# EAGLE schematic synapse (EAGLE 7.3.0)

## Sheet 1 of 2
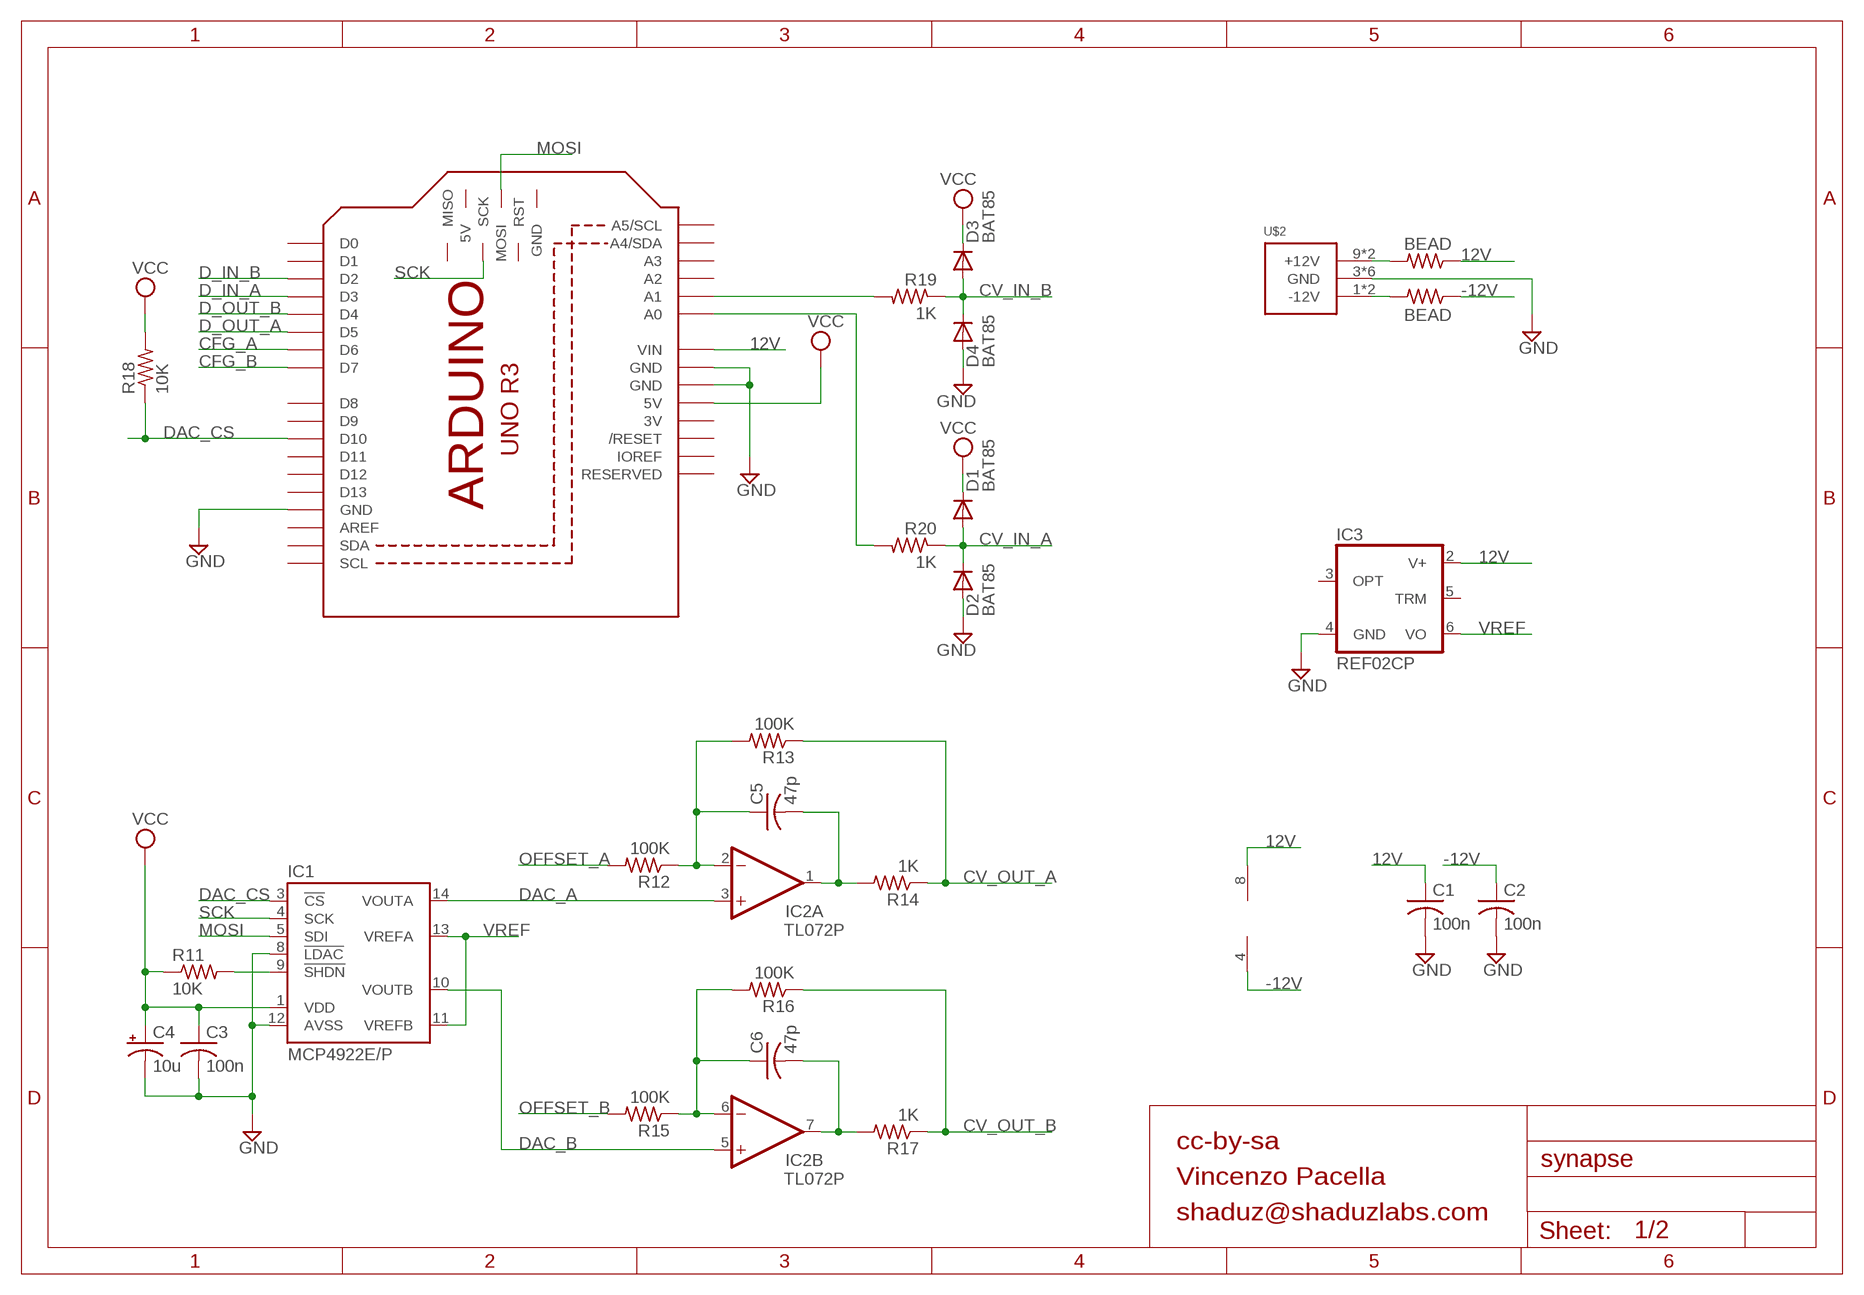
[diagram p0: schematic, sheet 1]

### Parts
C1  100n  C-US025-025X050  [C025-025X050]
C2  100n  C-US025-025X050  [C025-025X050]
C3  100n  C-US025-025X050  [C025-025X050]
C4  10u  CPOL-USE2-5  [E2-5]
C5  47p  C-US025-025X050  [C025-025X050]
C6  47p  C-US025-025X050  [C025-025X050]
D1  BAT85  DIODE-D-5  [D-5]
D2  BAT85  DIODE-D-5  [D-5]
D3  BAT85  DIODE-D-5  [D-5]
D4  BAT85  DIODE-D-5  [D-5]
IC1  MCP4922E/P  [DIL14]
IC2  TL072P  [DIL08]
IC3  REF02CP  REF02Z  [DIL08]
M1  ARDUINO_R3_ICSP  [ARDUINOR3_ICSP]
R11  10K  R-US_0204/7  [0204/7]
R12  100K  R-US_0204/7  [0204/7]
R13  100K  R-US_0204/7  [0204/7]
R14  1K  R-US_0204/7  [0204/7]
R15  100K  R-US_0204/7  [0204/7]
R16  100K  R-US_0204/7  [0204/7]
R17  1K  R-US_0204/7  [0204/7]
R18  10K  R-US_0204/7  [0204/7]
R19  1K  R-US_0204/7  [0204/7]
R20  1K  R-US_0204/7  [0204/7]
R21  BEAD  R-US_0204/7  [0204/7]
R24  BEAD  R-US_0204/7  [0204/7]
U$2  POWER_SIMPLE10  [POWER_10]

### Nets
12V [PWR]: C1.1 IC2.8(P:V+) IC3.2(V+) M1.VIN R21.1
-12V [PWR]: C2.1 IC2.4(P:V-) R24.1
CFG_A: M1.D6 ; also sheet 2
CFG_B: M1.D7 ; also sheet 2
CV_IN_A: D1.A D2.C R20.1 ; also sheet 2
CV_IN_B: D3.A D4.C R19.1 ; also sheet 2
CV_OUT_A: R13.1 R14.1 ; also sheet 2
CV_OUT_B: R16.1 R17.1 ; also sheet 2
D_IN_A: M1.D3 ; also sheet 2
D_IN_B: M1.D2 ; also sheet 2
D_OUT_A: M1.D5 ; also sheet 2
D_OUT_B: M1.D4 ; also sheet 2
DAC_A: IC1.14(VOUTA) IC2.3(A:+IN)
DAC_B: IC1.10(VOUTB) IC2.5(B:+IN)
DAC_CS: IC1.3(!CS!) M1.D10 R18.1
GND [PWR]: C1.2 C2.2 C3.2 C4.- D2.A D4.A IC1.8(!LDAC!) IC1.12(AVSS) IC3.4(GND) M1.GND M1.GND@1(GND) M1.GND@3(GND) U$2.3(GND) U$2.4(GND) U$2.5(GND) U$2.6(GND) U$2.7(GND) U$2.8(GND) ; also sheet 2
MOSI: IC1.5(SDI) M1.MOSI
N$1: M1.A1 R19.2
N$2: IC1.9(!SHDN!) R11.2
N$5 [PWR]: R21.2 U$2.9(+12V) U$2.10(+12V)
N$8 [PWR]: R24.2 U$2.1(-12V) U$2.2(-12V)
N$9: M1.A0 R20.2
N$22: C5.1 IC2.2(A:-IN) R12.1 R13.2
N$23: C6.1 IC2.6(B:-IN) R15.1 R16.2
N$24: C5.2 IC2.1(A:OUT) R14.2
N$25: C6.2 IC2.7(B:OUT) R17.2
OFFSET_A: R12.2 ; also sheet 2
OFFSET_B: R15.2 ; also sheet 2
SCK: IC1.4(SCK) M1.SCK
VCC: C3.1 C4.+ D1.C D3.C IC1.1(VDD) M1.5V R11.1 R18.2 ; also sheet 2
VREF: IC1.11(VREFB) IC1.13(VREFA) IC3.6(VO) ; also sheet 2
Unconnected: IC3.3(OPT) IC3.5(TRM) M1.5V_ICSP(5V) M1.A2 M1.A3 M1.A4(A4/SDA) M1.A5(A5/SCL) M1.AREF M1.D0 M1.D1 M1.D8 M1.D9 M1.D11 M1.D12 M1.D13 M1.GND@2(GND) M1.IOREF M1.MISO M1.RESERVED M1.RESET(/RESET) M1.RESET_ICSP(RST) M1.SCL M1.SDA

### Notes on the sheet
- cc-by-sa
- Vincenzo Pacella
- shaduz@shaduzlabs.com

## Sheet 2 of 2
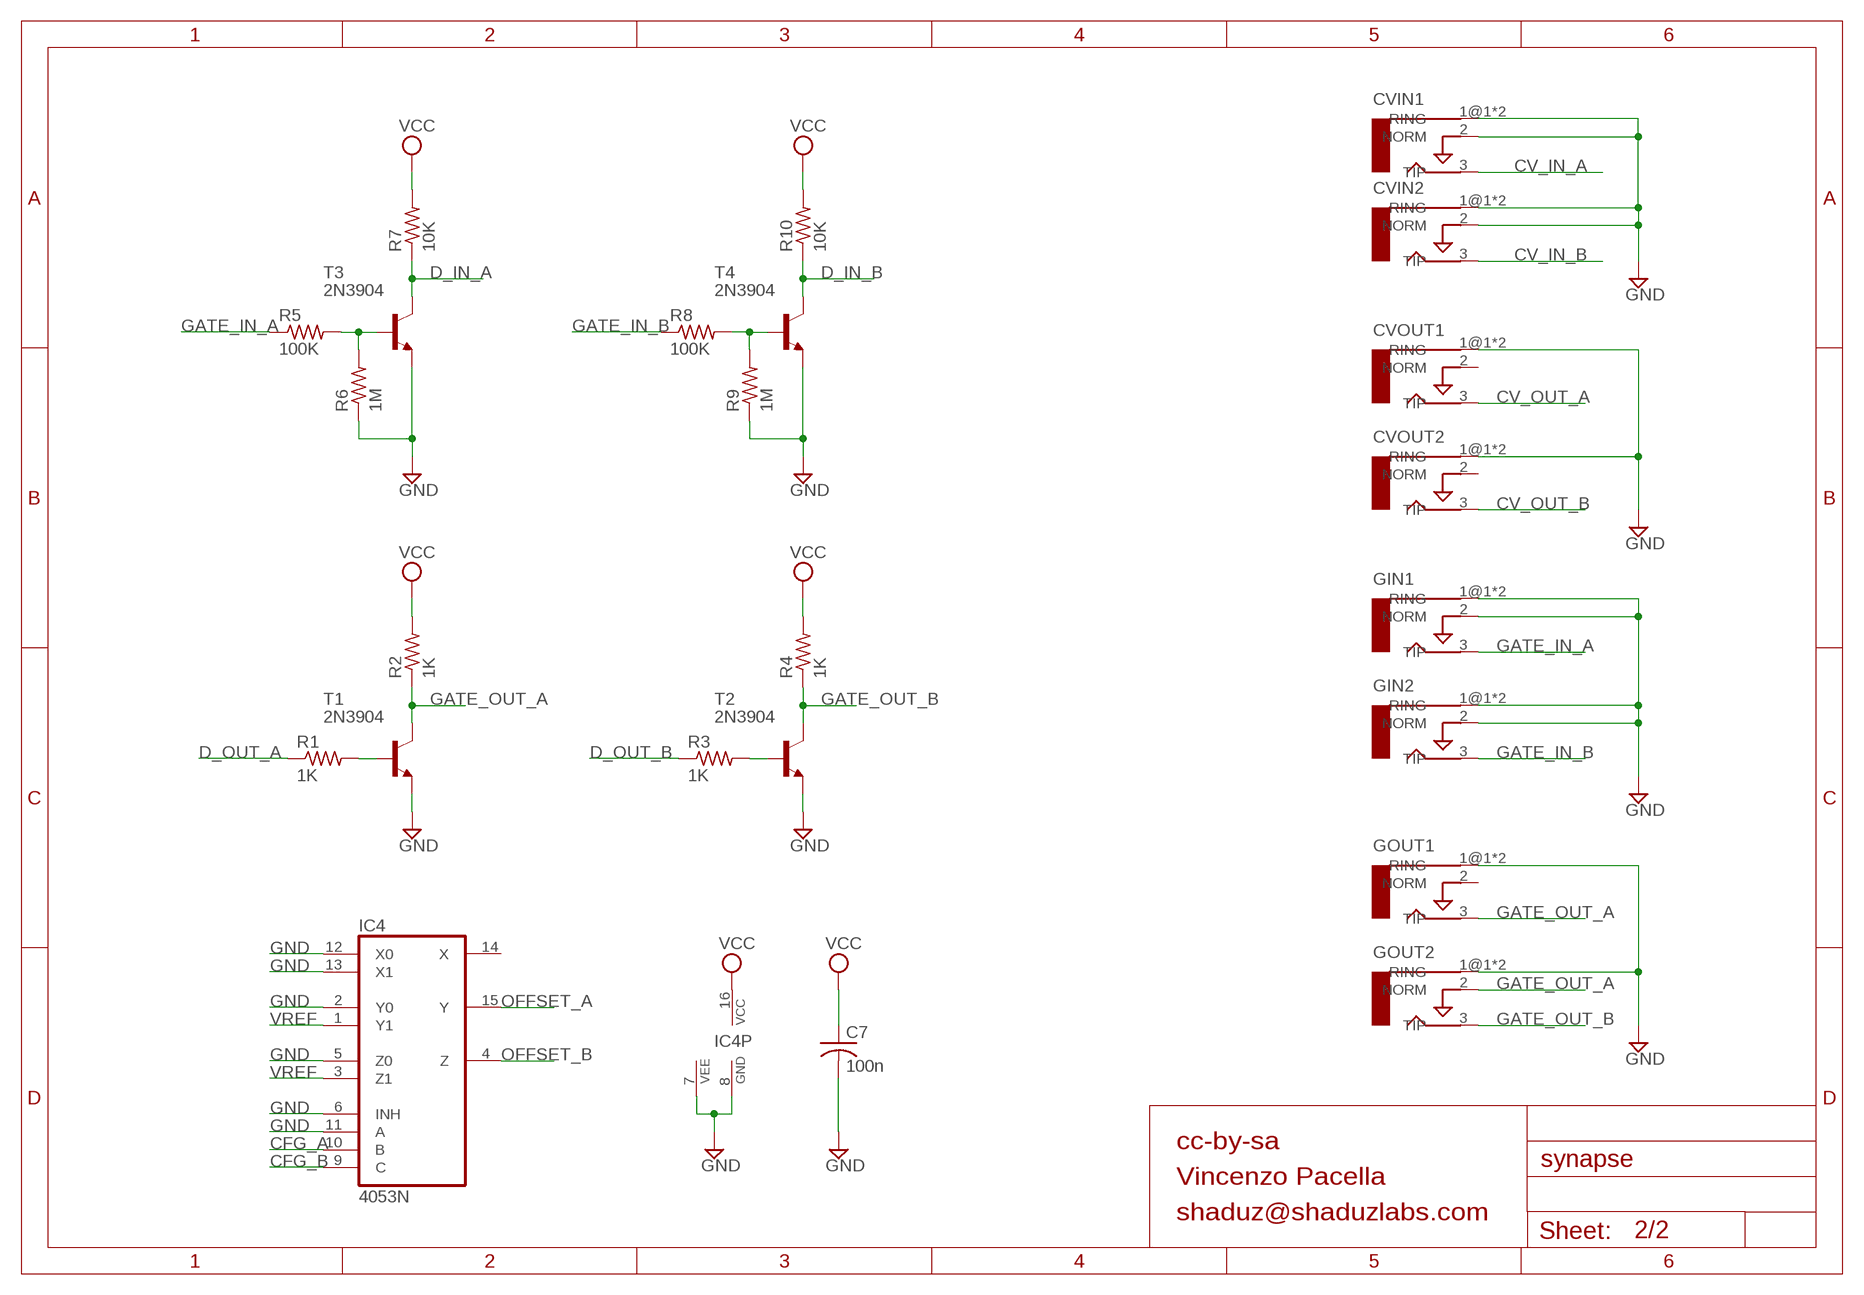
[diagram p1: schematic, sheet 2]

### Parts
C7  100n  C-US025-025X050  [C025-025X050]
CVIN1  AUDIO-JACKERTHENVAR  [ERTHENVAR-JACK]
CVIN2  AUDIO-JACKERTHENVAR  [ERTHENVAR-JACK]
CVOUT1  AUDIO-JACKERTHENVAR  [ERTHENVAR-JACK]
CVOUT2  AUDIO-JACKERTHENVAR  [ERTHENVAR-JACK]
GIN1  AUDIO-JACKERTHENVAR  [ERTHENVAR-JACK]
GIN2  AUDIO-JACKERTHENVAR  [ERTHENVAR-JACK]
GOUT1  AUDIO-JACKERTHENVAR  [ERTHENVAR-JACK]
GOUT2  AUDIO-JACKERTHENVAR  [ERTHENVAR-JACK]
IC4  4053N  [DIL16]
R1  1K  R-US_0204/7  [0204/7]
R2  1K  R-US_0204/7  [0204/7]
R3  1K  R-US_0204/7  [0204/7]
R4  1K  R-US_0204/7  [0204/7]
R5  100K  R-US_0204/7  [0204/7]
R6  1M  R-US_0204/7  [0204/7]
R7  10K  R-US_0204/7  [0204/7]
R8  100K  R-US_0204/7  [0204/7]
R9  1M  R-US_0204/7  [0204/7]
R10  10K  R-US_0204/7  [0204/7]
T1  2N3904  2N3904-NPN-TO92-EBC  [TO92-EBC]
T2  2N3904  2N3904-NPN-TO92-EBC  [TO92-EBC]
T3  2N3904  2N3904-NPN-TO92-EBC  [TO92-EBC]
T4  2N3904  2N3904-NPN-TO92-EBC  [TO92-EBC]

### Nets
CFG_A: IC4.10(B) ; also sheet 1
CFG_B: IC4.9(C) ; also sheet 1
CV_IN_A: CVIN1.3(TIP) ; also sheet 1
CV_IN_B: CVIN2.3(TIP) ; also sheet 1
CV_OUT_A: CVOUT1.3(TIP) ; also sheet 1
CV_OUT_B: CVOUT2.3(TIP) ; also sheet 1
D_IN_A: R7.1 T3.C ; also sheet 1
D_IN_B: R10.1 T4.C ; also sheet 1
D_OUT_A: R1.1 ; also sheet 1
D_OUT_B: R3.1 ; also sheet 1
GATE_IN_A: GIN1.3(TIP) R5.1
GATE_IN_B: GIN2.3(TIP) R8.1
GATE_OUT_A: GOUT1.3(TIP) GOUT2.2(NORM) R2.1 T1.C
GATE_OUT_B: GOUT2.3(TIP) R4.1 T2.C
GND [PWR]: C7.2 CVIN1.1@1(RING) CVIN1.1@2(RING) CVIN1.2(NORM) CVIN2.1@1(RING) CVIN2.1@2(RING) CVIN2.2(NORM) CVOUT1.1@1(RING) CVOUT1.1@2(RING) CVOUT2.1@1(RING) CVOUT2.1@2(RING) GIN1.1@1(RING) GIN1.1@2(RING) GIN1.2(NORM) GIN2.1@1(RING) GIN2.1@2(RING) GIN2.2(NORM) GOUT1.1@1(RING) GOUT1.1@2(RING) GOUT2.1@1(RING) GOUT2.1@2(RING) IC4.2(Y0) IC4.5(Z0) IC4.6(INH) IC4.7(VEE) IC4.8(GND) IC4.11(A) IC4.12(X0) IC4.13(X1) R6.1 R9.1 T1.E T2.E T3.E T4.E ; also sheet 1
N$3: R1.2 T1.B
N$4: R3.2 T2.B
N$6: R5.2 R6.2 T3.B
N$7: R8.2 R9.2 T4.B
OFFSET_A: IC4.15(Y) ; also sheet 1
OFFSET_B: IC4.4(Z) ; also sheet 1
VCC: C7.1 IC4.16(VCC) R2.2 R4.2 R7.2 R10.2 ; also sheet 1
VREF: IC4.1(Y1) IC4.3(Z1) ; also sheet 1
Unconnected: CVOUT1.2(NORM) CVOUT2.2(NORM) GOUT1.2(NORM) IC4.14(X)

### Notes on the sheet
- cc-by-sa
- Vincenzo Pacella
- shaduz@shaduzlabs.com

## Power pins joined to a net without a drawn wire
3V: M1.3V

## Library data of the parts
C1-C3 C5-C7 = resistor:C-US: CAPACITOR, American symbol
C4 = resistor:CPOL-US: POLARIZED CAPACITOR, American symbol
CVIN1 CVIN2 CVOUT1 CVOUT2 GIN1 GIN2 GOUT1 GOUT2 = erthenvar:AUDIO-JACK: Switching Mono 3.5mm Audio Jack from Erthenvar.
D1-D4 = diode:DIODE-: DIODE
IC1 = nh-mcp4921-mcp4922:MCP4922
IC2 = linear:TL072: OP AMP
IC3 = linear:REF02: VOLTAGE REFERENCE
IC4 = 40xx:4053: Triple 2-channel ANALOG MULTIPLEXER
M1 = adafruit:ARDUINO_R3_ICSP
R1-R21 R24 = rcl:R-US_: RESISTOR, American symbol
T1-T4 = transistor-neu-to92:*-NPN-: NPN Transistror
U$2 = eurorack:POWER_SIMPLE

## Net classes
1 PWR: width 0.457 mm, clearance 0.203 mm